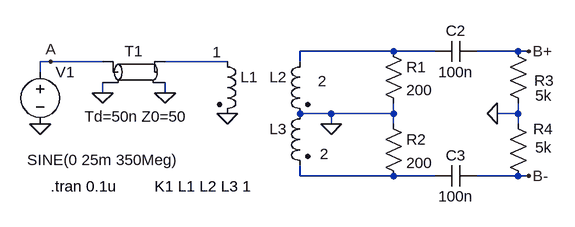
[diagram p0: schematic FD transformer.asc]
FD transformer.asc, the LTspice schematic file:
Version 4
SHEET 1 880 680
WIRE 368 128 224 128
WIRE 432 128 368 128
WIRE 560 128 496 128
WIRE 576 128 560 128
WIRE -160 144 -176 144
WIRE -80 144 -160 144
WIRE 112 144 16 144
WIRE 224 144 224 128
WIRE -176 160 -176 144
WIRE -80 192 -80 176
WIRE 16 192 16 176
WIRE 272 224 224 224
WIRE 368 224 368 208
WIRE 368 224 272 224
WIRE 560 224 560 208
WIRE 560 224 528 224
WIRE 272 240 272 224
WIRE 368 240 368 224
WIRE 560 240 560 224
WIRE 224 320 224 304
WIRE 368 320 224 320
WIRE 432 320 368 320
WIRE 560 320 496 320
WIRE 576 320 560 320
FLAG 112 224 0
FLAG 272 240 0
FLAG -176 240 0
FLAG 528 224 0
FLAG -80 192 0
FLAG 16 192 0
FLAG 576 128 B+
FLAG 576 320 B-
FLAG -160 144 A
SYMBOL voltage -176 144 R0
WINDOW 3 -20 151 Left 2
WINDOW 123 0 0 Left 0
WINDOW 39 24 44 Left 2
SYMATTR Value SINE(0 25m 350Meg)
SYMATTR InstName V1
SYMBOL ind2 96 128 R0
WINDOW 3 -7 1 Left 2
SYMATTR Value 1
SYMATTR InstName L1
SYMATTR Type ind
SYMBOL ind2 240 128 M0
WINDOW 3 -25 46 Left 2
SYMATTR Value 2
SYMATTR InstName L2
SYMATTR Type ind
SYMBOL ind2 240 208 M0
WINDOW 3 -28 78 Left 2
SYMATTR Value 2
SYMATTR InstName L3
SYMATTR Type ind
SYMBOL res 352 112 R0
SYMATTR InstName R1
SYMATTR Value 200
SYMBOL res 352 224 R0
SYMATTR InstName R2
SYMATTR Value 200
SYMBOL cap 496 112 R90
WINDOW 0 0 32 VBottom 2
WINDOW 3 32 32 VTop 2
SYMATTR InstName C2
SYMATTR Value 100n
SYMBOL cap 496 304 R90
WINDOW 0 0 32 VBottom 2
WINDOW 3 32 32 VTop 2
SYMATTR InstName C3
SYMATTR Value 100n
SYMBOL res 544 112 R0
WINDOW 0 41 61 Left 2
WINDOW 3 42 84 Left 2
SYMATTR InstName R3
SYMATTR Value 5k
SYMBOL res 544 224 R0
WINDOW 0 39 24 Left 2
WINDOW 3 42 52 Left 2
SYMATTR InstName R4
SYMATTR Value 5k
SYMBOL tline -32 160 R0
WINDOW 3 4 53 Top 2
SYMATTR InstName T1
TEXT 0 336 Left 2 !K1 L1 L2 L3 1
TEXT -160 336 Left 2 !.tran 0.1u

The netlist it stands for:
* FD transformer.asc
V1 A 0 SINE(0 25m 350Meg)
L1 N002 0 1
L2 N001 0 2
L3 0 N003 2
R1 N001 0 200
R2 0 N003 200
C2 B+ N001 100n
C3 B- N003 100n
R3 B+ 0 5k
R4 0 B- 5k
T1 A 0 N002 0 Td=50n Z0=50
K1 L1 L2 L3 1
.tran 0.1u
.backanno
.end

* Results of the author's LTspice run, read from the files saved beside the schematic
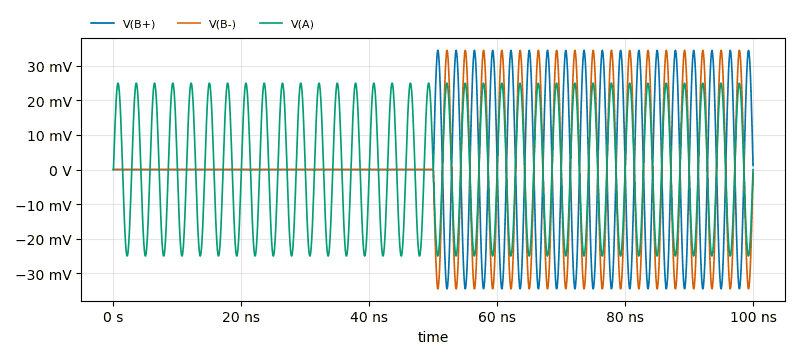
[diagram p1: Transient Analysis of FD transformer.asc, plotted from the saved traces]
* Transient Analysis, 1 run:
*   V(B+): min -34.46 mV, max 34.46 mV, average 310.2 µV, rms 17.17 mV, last 1.166 mV
*   V(B-): min -34.46 mV, max 34.46 mV, average -310.2 µV, rms 17.17 mV, last -1.166 mV
*   V(A): min -24.99 mV, max 24.99 mV, average 161.7 nV, rms 17.69 mV, last 0 V